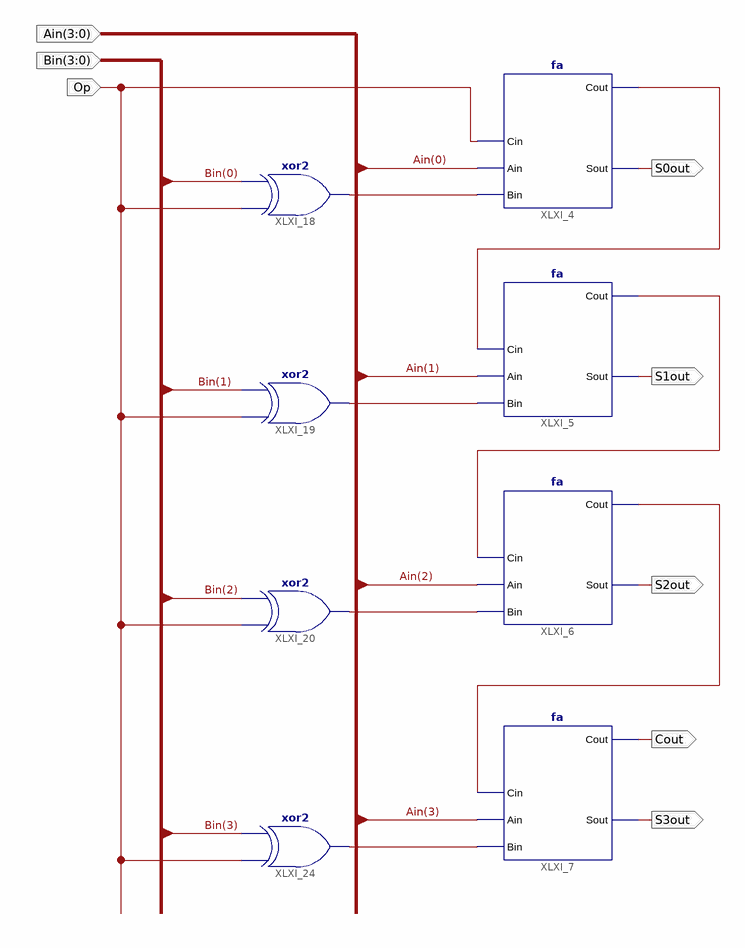
[diagram p0: schematic sheet 1]
// Xilinx ISE schematic FA4b.sch (spartan3e) as structural Verilog: 8 symbols, 8 ports
module FA4b (
  input  [3:0] Bin,
  input  [3:0] Ain,
  input  Op,
  output S0out,
  output S1out,
  output S2out,
  output S3out,
  output Cout
);

  wire XLXN_22, XLXN_23, XLXN_24, XLXN_56, XLXN_57, XLXN_58, XLXN_85;

  fa XLXI_4 (.Cin(Op), .Cout(XLXN_22), .Ain(Ain[0]), .Bin(XLXN_57), .Sout(S0out));
  fa XLXI_5 (.Cin(XLXN_22), .Cout(XLXN_23), .Ain(Ain[1]), .Bin(XLXN_56), .Sout(S1out));
  fa XLXI_6 (.Cin(XLXN_23), .Cout(XLXN_24), .Ain(Ain[2]), .Bin(XLXN_58), .Sout(S2out));
  fa XLXI_7 (.Cin(XLXN_24), .Cout(Cout), .Ain(Ain[3]), .Bin(XLXN_85), .Sout(S3out));
  xor XLXI_18 (XLXN_57, Op, Bin[0]);
  xor XLXI_19 (XLXN_56, Op, Bin[1]);
  xor XLXI_20 (XLXN_58, Op, Bin[2]);
  xor XLXI_24 (XLXN_85, Op, Bin[3]);
endmodule
